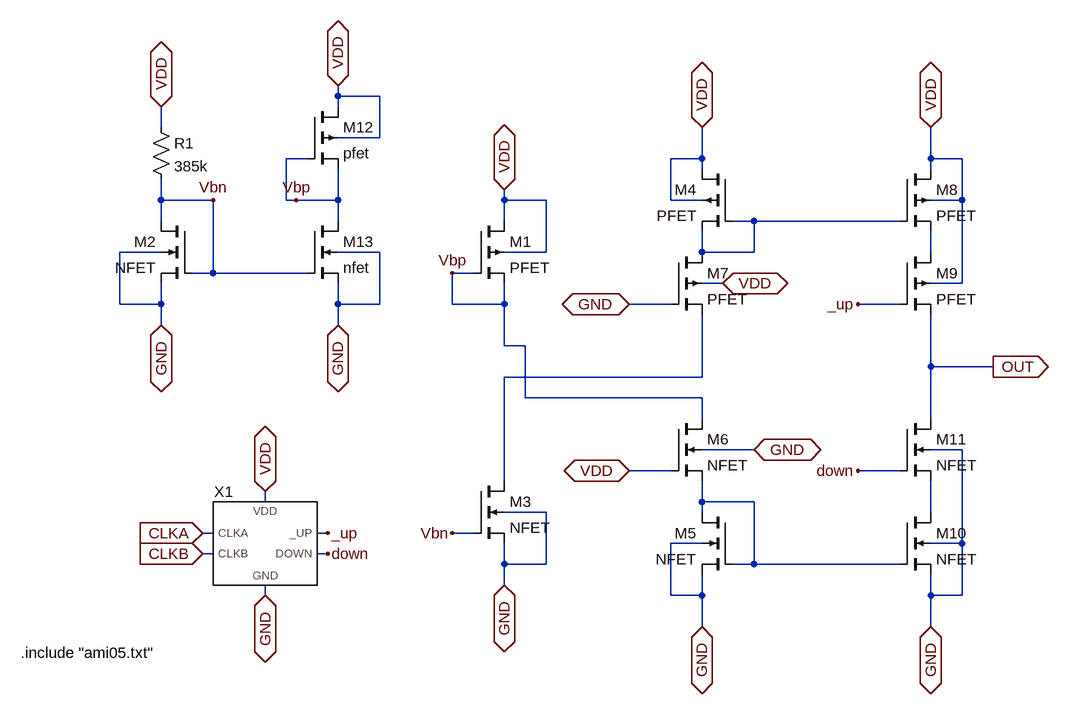
[diagram p0: schematic chargePump.asc]
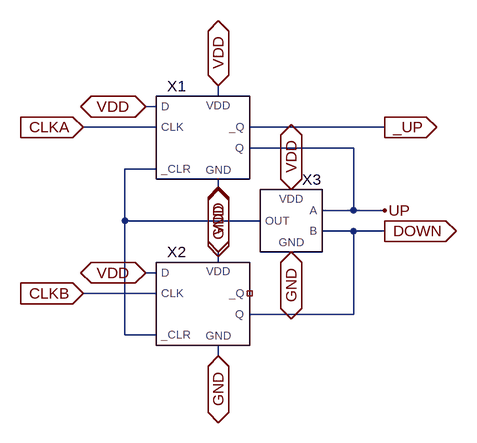
[diagram p1: sub-circuit phasedetector.asc]
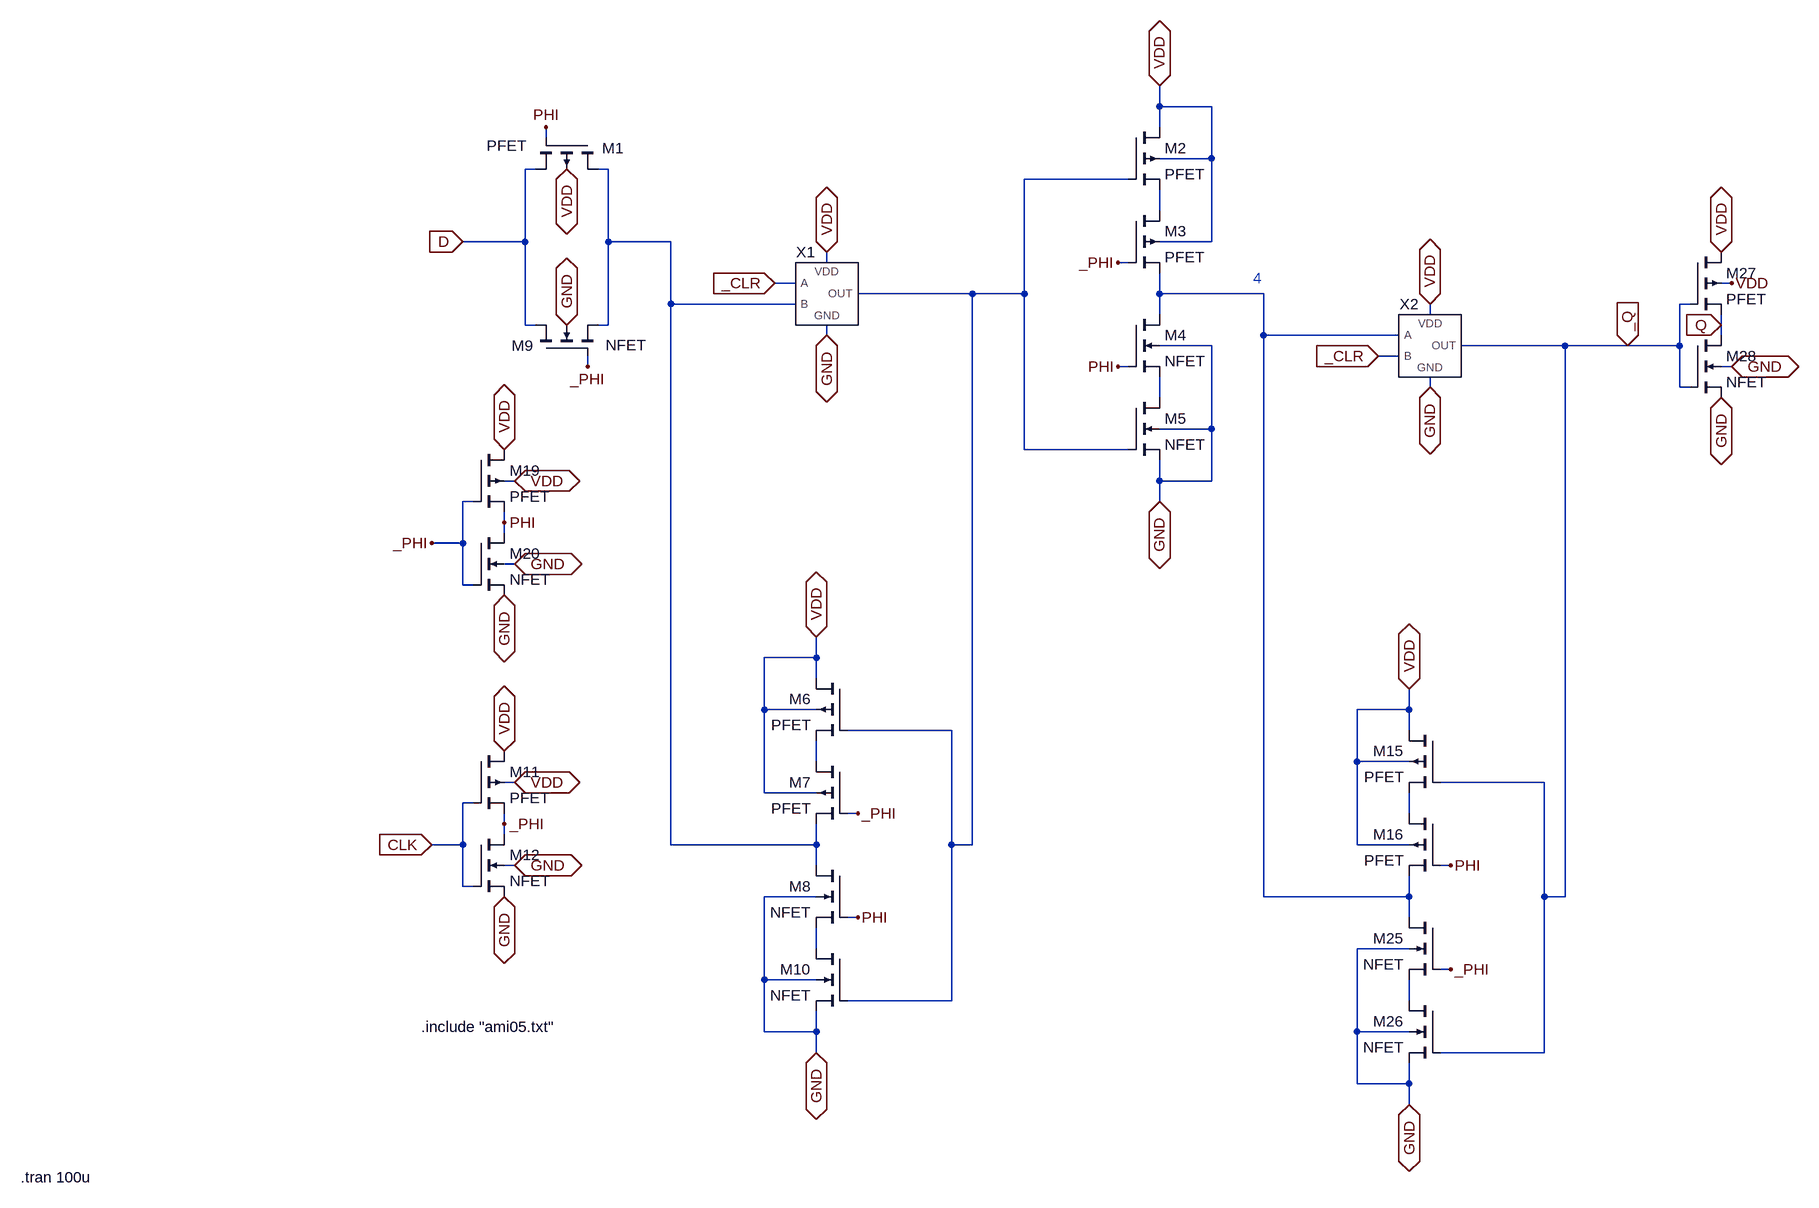
[diagram p2: sub-circuit ffd.asc]
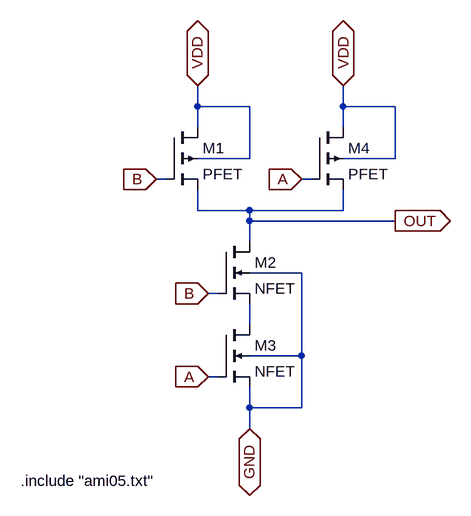
[diagram p3: sub-circuit nand.asc]
chargePump.asc, the LTspice schematic file:
Version 4
SHEET 1 1812 688
WIRE 240 -256 240 -272
WIRE 304 -256 240 -256
WIRE 240 -240 240 -256
WIRE -32 -208 -32 -240
WIRE 304 -192 304 -256
WIRE 304 -192 240 -192
WIRE 192 -160 160 -160
WIRE 800 -160 800 -208
WIRE 800 -160 752 -160
WIRE 1152 -160 1152 -208
WIRE 1200 -160 1152 -160
WIRE 800 -144 800 -160
WIRE 1152 -144 1152 -160
WIRE -32 -96 -32 -128
WIRE 48 -96 -32 -96
WIRE 160 -96 160 -160
WIRE 176 -96 160 -96
WIRE 240 -96 240 -144
WIRE 240 -96 176 -96
WIRE 496 -96 496 -112
WIRE 560 -96 496 -96
WIRE 752 -96 752 -160
WIRE 800 -96 752 -96
WIRE 1200 -96 1200 -160
WIRE 1200 -96 1152 -96
WIRE -32 -64 -32 -96
WIRE 240 -64 240 -96
WIRE 496 -64 496 -96
WIRE 880 -64 848 -64
WIRE 1104 -64 880 -64
WIRE -32 -16 -96 -16
WIRE 304 -16 240 -16
WIRE 560 -16 560 -96
WIRE 560 -16 496 -16
WIRE 800 -16 800 -48
WIRE 880 -16 880 -64
WIRE 880 -16 800 -16
WIRE 1152 -16 1152 -48
WIRE 48 16 48 -96
WIRE 48 16 16 16
WIRE 192 16 48 16
WIRE 448 16 416 16
WIRE 832 32 800 32
WIRE 1200 32 1200 -96
WIRE 1200 32 1152 32
WIRE -96 64 -96 -16
WIRE -32 64 -32 32
WIRE -32 64 -96 64
WIRE 240 64 240 32
WIRE 304 64 304 -16
WIRE 304 64 240 64
WIRE 416 64 416 16
WIRE 496 64 496 32
WIRE 496 64 416 64
WIRE 752 64 688 64
WIRE 1104 64 1040 64
WIRE -32 96 -32 64
WIRE 240 96 240 64
WIRE 496 128 496 64
WIRE 528 128 496 128
WIRE 1152 160 1152 80
WIRE 1248 160 1152 160
WIRE 800 176 800 80
WIRE 800 176 496 176
WIRE 528 208 528 128
WIRE 800 208 528 208
WIRE 800 240 800 208
WIRE 1152 240 1152 160
WIRE 880 288 800 288
WIRE 1200 288 1152 288
WIRE 752 320 688 320
WIRE 1104 320 1040 320
WIRE 496 336 496 176
WIRE 128 368 128 352
WIRE 800 368 800 336
WIRE 880 368 800 368
WIRE 560 384 496 384
WIRE 800 384 800 368
WIRE 1152 384 1152 336
WIRE 48 416 32 416
WIRE 224 416 208 416
WIRE 448 416 416 416
WIRE 800 432 752 432
WIRE 1200 432 1200 288
WIRE 1200 432 1152 432
WIRE 48 448 32 448
WIRE 224 448 208 448
WIRE 496 464 496 432
WIRE 560 464 560 384
WIRE 560 464 496 464
WIRE 880 464 880 368
WIRE 880 464 848 464
WIRE 1104 464 880 464
WIRE 496 496 496 464
WIRE 128 512 128 496
WIRE 752 512 752 432
WIRE 800 512 800 480
WIRE 800 512 752 512
WIRE 1152 512 1152 480
WIRE 1200 512 1200 432
WIRE 1200 512 1152 512
WIRE 800 560 800 512
WIRE 1152 560 1152 512
FLAG -32 -240 VDD
IOPIN -32 -240 BiDir
FLAG -32 96 GND
IOPIN -32 96 BiDir
FLAG 496 496 GND
IOPIN 496 496 BiDir
FLAG 48 -96 Vbn
FLAG 416 16 Vbp
FLAG 496 -112 VDD
IOPIN 496 -112 BiDir
FLAG 416 416 Vbn
FLAG 224 448 down
FLAG 128 352 VDD
IOPIN 128 352 BiDir
FLAG 128 512 GND
IOPIN 128 512 BiDir
FLAG 224 416 _up
FLAG 32 448 CLKB
IOPIN 32 448 In
FLAG 32 416 CLKA
IOPIN 32 416 In
FLAG 176 -96 Vbp
FLAG 240 96 GND
IOPIN 240 96 BiDir
FLAG 240 -272 VDD
IOPIN 240 -272 BiDir
FLAG 1040 64 _up
FLAG 1040 320 down
FLAG 688 320 VDD
IOPIN 688 320 BiDir
FLAG 800 -208 VDD
IOPIN 800 -208 BiDir
FLAG 1152 -208 VDD
IOPIN 1152 -208 BiDir
FLAG 832 32 VDD
IOPIN 832 32 BiDir
FLAG 800 560 GND
IOPIN 800 560 BiDir
FLAG 1152 560 GND
IOPIN 1152 560 BiDir
FLAG 688 64 GND
IOPIN 688 64 BiDir
FLAG 1248 160 OUT
IOPIN 1248 160 Out
FLAG 880 288 GND
IOPIN 880 288 BiDir
SYMBOL pmos4 448 -64 R0
SYMATTR InstName M1
SYMATTR Value2 l=1.2u w=7.8u
SYMATTR Value PFET
SYMBOL nmos4 16 -64 M0
SYMATTR InstName M2
SYMATTR Value2 l=1.2u w=2.4u
SYMATTR Value NFET
SYMBOL res -48 -224 R0
SYMATTR InstName R1
SYMATTR Value 385k
SYMBOL nmos4 448 336 R0
SYMATTR InstName M3
SYMATTR Value2 l=1.2u w=2.4u
SYMATTR Value NFET
SYMBOL phaseDetector 128 432 R0
SYMATTR InstName X1
SYMBOL pmos4 192 -240 R0
SYMATTR InstName M12
SYMATTR Value pfet
SYMATTR Value2 l=1.2u w=7.8u
SYMBOL nmos4 192 -64 R0
SYMATTR InstName M13
SYMATTR Value nfet
SYMATTR Value2 l=1.2u w=2.4u
SYMBOL pmos4 848 -144 M0
SYMATTR InstName M4
SYMATTR Value PFET
SYMATTR Value2 l=1.2u w=7.8u
SYMBOL nmos4 848 384 M0
SYMATTR InstName M5
SYMATTR Value NFET
SYMATTR Value2 l=1.2u w=2.4u
SYMBOL nmos4 752 240 R0
SYMATTR InstName M6
SYMATTR Value NFET
SYMATTR Value2 l=0.6u w=1.5u
SYMBOL pmos4 752 -16 R0
SYMATTR InstName M7
SYMATTR Value PFET
SYMATTR Value2 l=0.6u w=3u
SYMBOL pmos4 1104 -144 R0
SYMATTR InstName M8
SYMATTR Value PFET
SYMATTR Value2 l=1.2u w=7.8u
SYMBOL pmos4 1104 -16 R0
SYMATTR InstName M9
SYMATTR Value PFET
SYMATTR Value2 l=0.6u w=3u
SYMBOL nmos4 1104 384 R0
SYMATTR InstName M10
SYMATTR Value NFET
SYMATTR Value2 l=1.2u w=2.4u
SYMBOL nmos4 1104 240 R0
SYMATTR InstName M11
SYMATTR Value NFET
SYMATTR Value2 l=0.6u w=1.5u
TEXT -248 600 Left 2 !.include "ami05.txt"

phasedetector.asc, the sub-circuit schematic file:
Version 4
SHEET 1 880 680
WIRE 176 64 176 48
WIRE 80 80 64 80
WIRE 80 112 -32 112
WIRE 432 112 224 112
WIRE 384 144 224 144
WIRE 80 176 32 176
WIRE 176 208 176 192
WIRE 384 240 384 144
WIRE 384 240 336 240
WIRE 432 240 384 240
WIRE 32 256 32 176
WIRE 240 256 32 256
WIRE 384 272 336 272
WIRE 432 272 384 272
WIRE 176 320 176 304
WIRE 80 336 64 336
WIRE 80 368 -32 368
WIRE 384 400 384 272
WIRE 384 400 224 400
WIRE 32 432 32 256
WIRE 80 432 32 432
WIRE 176 464 176 448
FLAG 176 464 GND
IOPIN 176 464 BiDir
FLAG 176 208 GND
IOPIN 176 208 BiDir
FLAG 176 304 VDD
IOPIN 176 304 BiDir
FLAG 176 48 VDD
IOPIN 176 48 BiDir
FLAG 64 80 VDD
IOPIN 64 80 BiDir
FLAG 64 336 VDD
IOPIN 64 336 BiDir
FLAG -32 112 CLKA
IOPIN -32 112 In
FLAG -32 368 CLKB
IOPIN -32 368 In
FLAG 288 208 VDD
IOPIN 288 208 BiDir
FLAG 288 304 GND
IOPIN 288 304 BiDir
FLAG 432 112 _UP
IOPIN 432 112 Out
FLAG 432 272 DOWN
IOPIN 432 272 Out
FLAG 432 240 UP
SYMBOL FFD 160 144 R0
SYMATTR InstName X1
SYMBOL FFD 160 400 R0
SYMATTR InstName X2
SYMBOL NAND 288 256 M0
SYMATTR InstName X3

ffd.asc, the sub-circuit schematic file:
Version 4
SHEET 1 2988 1332
WIRE 992 -336 992 -368
WIRE 1072 -336 992 -336
WIRE 992 -304 992 -336
WIRE 48 -288 48 -304
WIRE 1072 -256 1072 -336
WIRE 1072 -256 992 -256
WIRE 32 -240 16 -240
WIRE 144 -240 128 -240
WIRE 944 -224 784 -224
WIRE 992 -176 992 -208
WIRE 16 -128 16 -240
WIRE 16 -128 -80 -128
WIRE 144 -128 144 -240
WIRE 240 -128 144 -128
WIRE 1072 -128 1072 -256
WIRE 1072 -128 992 -128
WIRE 480 -96 480 -112
WIRE 944 -96 928 -96
WIRE 432 -64 400 -64
WIRE 1872 -64 1856 -64
WIRE 704 -48 528 -48
WIRE 784 -48 784 -224
WIRE 784 -48 704 -48
WIRE 992 -48 992 -80
WIRE 1152 -48 992 -48
WIRE 240 -32 240 -128
WIRE 432 -32 240 -32
WIRE 1808 -32 1792 -32
WIRE 992 -16 992 -48
WIRE 1408 -16 1408 -32
WIRE 16 0 16 -128
WIRE 32 0 16 0
WIRE 144 0 144 -128
WIRE 144 0 128 0
WIRE 1856 0 1856 -16
WIRE 480 16 480 0
WIRE 1152 16 1152 -48
WIRE 1360 16 1152 16
WIRE 1856 16 1856 0
WIRE 1072 32 992 32
WIRE 1616 32 1456 32
WIRE 1712 32 1616 32
WIRE 1792 32 1792 -32
WIRE 1792 32 1712 32
WIRE 1360 48 1328 48
WIRE 112 64 112 48
WIRE 944 64 928 64
WIRE 1872 64 1856 64
WIRE 1408 96 1408 80
WIRE 1792 96 1792 32
WIRE 1808 96 1792 96
WIRE 992 112 992 80
WIRE 1072 160 1072 32
WIRE 1072 160 992 160
WIRE 784 192 784 -48
WIRE 944 192 784 192
WIRE 0 240 -16 240
WIRE 992 240 992 208
WIRE 1072 240 1072 160
WIRE 1072 240 992 240
WIRE -64 272 -80 272
WIRE 992 272 992 240
WIRE -16 304 -16 288
WIRE -16 320 -16 304
WIRE -80 336 -80 272
WIRE -80 336 -128 336
WIRE 0 368 -16 368
WIRE -80 400 -80 336
WIRE -64 400 -80 400
WIRE 464 512 464 480
WIRE 464 512 384 512
WIRE 464 544 464 512
WIRE 384 592 384 512
WIRE 464 592 384 592
WIRE 1376 592 1376 560
WIRE 1376 592 1296 592
WIRE 672 624 512 624
WIRE 1376 624 1376 592
WIRE 464 672 464 640
WIRE 1296 672 1296 592
WIRE 1376 672 1296 672
WIRE 0 704 -16 704
WIRE 1584 704 1424 704
WIRE 384 720 384 592
WIRE 464 720 384 720
WIRE -64 736 -80 736
WIRE 528 752 512 752
WIRE 1376 752 1376 720
WIRE -16 768 -16 752
WIRE -16 784 -16 768
WIRE -80 800 -80 736
WIRE -80 800 -128 800
WIRE 240 800 240 -32
WIRE 464 800 464 768
WIRE 464 800 240 800
WIRE 672 800 672 624
WIRE 704 800 704 -48
WIRE 704 800 672 800
WIRE 1296 800 1296 672
WIRE 1376 800 1296 800
WIRE 0 832 -16 832
WIRE 464 832 464 800
WIRE 1440 832 1424 832
WIRE -80 864 -80 800
WIRE -64 864 -80 864
WIRE 464 880 384 880
WIRE 1152 880 1152 16
WIRE 1376 880 1376 848
WIRE 1376 880 1152 880
WIRE 1584 880 1584 704
WIRE 1616 880 1616 32
WIRE 1616 880 1584 880
WIRE 528 912 512 912
WIRE 1376 912 1376 880
WIRE 464 960 464 928
WIRE 1376 960 1296 960
WIRE 1440 992 1424 992
WIRE 384 1008 384 880
WIRE 464 1008 384 1008
WIRE 672 1040 672 800
WIRE 672 1040 512 1040
WIRE 1376 1040 1376 1008
WIRE 384 1088 384 1008
WIRE 464 1088 464 1056
WIRE 464 1088 384 1088
WIRE 1296 1088 1296 960
WIRE 1376 1088 1296 1088
WIRE 464 1120 464 1088
WIRE 1584 1120 1584 880
WIRE 1584 1120 1424 1120
WIRE 1296 1168 1296 1088
WIRE 1376 1168 1376 1136
WIRE 1376 1168 1296 1168
WIRE 1376 1200 1376 1168
FLAG 80 -240 VDD
IOPIN 80 -240 BiDir
FLAG 48 -304 PHI
FLAG 112 64 _PHI
FLAG -80 -128 D
IOPIN -80 -128 In
FLAG 0 704 VDD
IOPIN 0 704 BiDir
FLAG -16 768 _PHI
FLAG -128 800 CLK
IOPIN -128 800 In
FLAG -16 880 GND
IOPIN -16 880 BiDir
FLAG 0 832 GND
IOPIN 0 832 BiDir
FLAG 80 0 GND
IOPIN 80 0 BiDir
FLAG 0 240 VDD
IOPIN 0 240 BiDir
FLAG -16 304 PHI
FLAG -128 336 _PHI
FLAG -16 416 GND
IOPIN -16 416 BiDir
FLAG 0 368 GND
IOPIN 0 368 BiDir
FLAG -16 192 VDD
IOPIN -16 192 BiDir
FLAG -16 656 VDD
IOPIN -16 656 BiDir
FLAG 992 -368 VDD
IOPIN 992 -368 BiDir
FLAG 992 272 GND
IOPIN 992 272 BiDir
FLAG 928 -96 _PHI
FLAG 928 64 PHI
FLAG 464 480 VDD
IOPIN 464 480 BiDir
FLAG 464 1120 GND
IOPIN 464 1120 BiDir
FLAG 528 752 _PHI
FLAG 528 912 PHI
FLAG 1376 560 VDD
IOPIN 1376 560 BiDir
FLAG 1376 1200 GND
IOPIN 1376 1200 BiDir
FLAG 1440 832 PHI
FLAG 1440 992 _PHI
FLAG 1872 -64 VDD
FLAG 1856 0 Q
IOPIN 1856 0 In
FLAG 1856 112 GND
IOPIN 1856 112 BiDir
FLAG 1872 64 GND
IOPIN 1872 64 BiDir
FLAG 1856 -112 VDD
IOPIN 1856 -112 BiDir
FLAG 1712 32 _Q
IOPIN 1712 32 In
FLAG 480 16 GND
IOPIN 480 16 BiDir
FLAG 1408 96 GND
IOPIN 1408 96 BiDir
FLAG 1408 -32 VDD
IOPIN 1408 -32 BiDir
FLAG 480 -112 VDD
IOPIN 480 -112 BiDir
FLAG 400 -64 _CLR
IOPIN 400 -64 In
FLAG 1328 48 _CLR
IOPIN 1328 48 In
SYMBOL pmos4 128 -288 R90
WINDOW 0 16 -40 VRight 2
WINDOW 3 12 110 VRight 2
SYMATTR InstName M1
SYMATTR Value PFET
SYMATTR Value2 l=600n w=6u
SYMBOL nmos4 32 48 R270
WINDOW 0 16 -37 VRight 2
WINDOW 3 17 108 VRight 2
SYMATTR InstName M9
SYMATTR Value NFET
SYMATTR Value2 l=600n w=3u
SYMBOL pmos4 -64 192 R0
SYMATTR InstName M19
SYMATTR Value2 l=600n w=3u
SYMATTR Value PFET
SYMBOL nmos4 -64 320 R0
SYMATTR InstName M20
SYMATTR Value2 l=600n w=1.5u
SYMATTR Value NFET
SYMBOL pmos4 944 -304 R0
SYMATTR InstName M2
SYMATTR Value2 l=600n w=6u
SYMATTR Value PFET
SYMBOL pmos4 944 -176 R0
SYMATTR InstName M3
SYMATTR Value2 l=600n w=6u
SYMATTR Value PFET
SYMBOL nmos4 944 -16 R0
SYMATTR InstName M4
SYMATTR Value2 l=600n w=3u
SYMATTR Value NFET
SYMBOL nmos4 944 112 R0
SYMATTR InstName M5
SYMATTR Value2 l=600n w=3u
SYMATTR Value NFET
SYMBOL pmos4 512 544 M0
SYMATTR InstName M6
SYMATTR Value2 l=600n w=6u
SYMATTR Value PFET
SYMBOL pmos4 512 672 M0
SYMATTR InstName M7
SYMATTR Value2 l=600n w=6u
SYMATTR Value PFET
SYMBOL nmos4 512 832 M0
SYMATTR InstName M8
SYMATTR Value2 l=600n w=3u
SYMATTR Value NFET
SYMBOL nmos4 512 960 M0
SYMATTR InstName M10
SYMATTR Value2 l=600n w=3u
SYMATTR Value NFET
SYMBOL pmos4 1424 624 M0
SYMATTR InstName M15
SYMATTR Value2 l=600n w=6u
SYMATTR Value PFET
SYMBOL pmos4 1424 752 M0
SYMATTR InstName M16
SYMATTR Value2 l=600n w=6u
SYMATTR Value PFET
SYMBOL nmos4 1424 912 M0
SYMATTR InstName M25
SYMATTR Value2 l=600n w=3u
SYMATTR Value NFET
SYMBOL nmos4 1424 1040 M0
SYMATTR InstName M26
SYMATTR Value2 l=600n w=3u
SYMATTR Value NFET
SYMBOL pmos4 1808 -112 R0
SYMATTR InstName M27
SYMATTR Value2 l=600n w=3u
SYMATTR Value PFET
SYMBOL nmos4 1808 16 R0
SYMATTR InstName M28
SYMATTR Value2 l=600n w=1.5u
SYMATTR Value NFET
SYMBOL NAND 480 -48 R0
SYMATTR InstName X1
SYMBOL NAND 1408 32 R0
SYMATTR InstName X2
SYMBOL pmos4 -64 656 R0
SYMATTR InstName M11
SYMATTR Value2 l=600n w=3u
SYMATTR Value PFET
SYMBOL nmos4 -64 784 R0
SYMATTR InstName M12
SYMATTR Value2 l=600n w=1.5u
SYMATTR Value NFET
TEXT -144 1080 Left 2 !.include "ami05.txt"
TEXT -760 1312 Left 2 !.tran 100u
TEXT 1136 -72 Left 2 ;4

nand.asc, the sub-circuit schematic file:
Version 4
SHEET 1 880 680
WIRE 32 -96 32 -128
WIRE 112 -96 32 -96
WIRE 256 -96 256 -128
WIRE 336 -96 256 -96
WIRE 32 -64 32 -96
WIRE 256 -64 256 -96
WIRE 112 -16 112 -96
WIRE 112 -16 32 -16
WIRE 336 -16 336 -96
WIRE 336 -16 256 -16
WIRE -16 16 -32 16
WIRE 208 16 192 16
WIRE 32 64 32 32
WIRE 112 64 32 64
WIRE 256 64 256 32
WIRE 256 64 112 64
WIRE 112 80 112 64
WIRE 336 80 112 80
WIRE 112 112 112 80
WIRE 192 160 112 160
WIRE 64 192 48 192
WIRE 112 240 112 208
WIRE 192 288 192 160
WIRE 192 288 112 288
WIRE 64 320 48 320
WIRE 112 368 112 336
WIRE 192 368 192 288
WIRE 192 368 112 368
WIRE 112 400 112 368
FLAG 112 400 GND
IOPIN 112 400 BiDir
FLAG 32 -128 VDD
IOPIN 32 -128 BiDir
FLAG 256 -128 VDD
IOPIN 256 -128 BiDir
FLAG 192 16 A
IOPIN 192 16 In
FLAG 48 320 A
IOPIN 48 320 In
FLAG 48 192 B
IOPIN 48 192 In
FLAG -32 16 B
IOPIN -32 16 In
FLAG 336 80 OUT
IOPIN 336 80 Out
SYMBOL pmos4 -16 -64 R0
SYMATTR InstName M1
SYMATTR Value2 l=600n w=3u
SYMATTR Value PFET
SYMBOL nmos4 64 112 R0
SYMATTR InstName M2
SYMATTR Value2 l=600n w=3u
SYMATTR Value NFET
SYMBOL nmos4 64 240 R0
SYMATTR InstName M3
SYMATTR Value2 l=600n w=3u
SYMATTR Value NFET
SYMBOL pmos4 208 -64 R0
SYMATTR InstName M4
SYMATTR Value2 l=600n w=3u
SYMATTR Value PFET
TEXT -240 480 Left 2 !.include "ami05.txt"

The netlist it stands for:
* chargePump.asc
M1 VDD Vbp Vbp VDD PFET l=1.2u w=7.8u
M2 Vbn Vbn GND GND NFET l=1.2u w=2.4u
R1 VDD Vbn 385k
M3 N003 Vbn GND GND NFET l=1.2u w=2.4u
XX1 CLKA CLKB down GND _up VDD phasedetector
M12 VDD Vbp Vbp VDD pfet l=1.2u w=7.8u
M13 Vbp Vbn GND GND nfet l=1.2u w=2.4u
M4 VDD N001 N001 VDD PFET l=1.2u w=7.8u
M5 N004 N004 GND GND NFET l=1.2u w=2.4u
M6 Vbp VDD N004 GND NFET l=0.6u w=1.5u
M7 N001 GND N003 VDD PFET l=0.6u w=3u
M8 VDD N001 N002 VDD PFET l=1.2u w=7.8u
M9 N002 _up OUT VDD PFET l=0.6u w=3u
M10 N005 N004 GND GND NFET l=1.2u w=2.4u
M11 OUT down N005 GND NFET l=0.6u w=1.5u

* block symbol definitions
.subckt phasedetector CLKA CLKB DOWN GND _UP VDD
XX1 N001 CLKA VDD UP _UP GND VDD ffd
XX2 N001 CLKB VDD DOWN NC_01 GND VDD ffd
XX3 UP DOWN GND N001 VDD nand
.ends phasedetector

.subckt ffd _CLR CLK D Q _Q GND VDD
M1 N001 PHI D VDD PFET l=600n w=6u
M9 D _PHI N001 GND NFET l=600n w=3u
M19 VDD _PHI PHI VDD PFET l=600n w=3u
M20 PHI _PHI GND GND NFET l=600n w=1.5u
M2 VDD N002 N003 VDD PFET l=600n w=6u
M3 N003 _PHI N004 VDD PFET l=600n w=6u
M4 N004 PHI N005 GND NFET l=600n w=3u
M5 N005 N002 GND GND NFET l=600n w=3u
M6 VDD N002 N006 VDD PFET l=600n w=6u
M7 N006 _PHI N001 VDD PFET l=600n w=6u
M8 N001 PHI N008 GND NFET l=600n w=3u
M10 N008 N002 GND GND NFET l=600n w=3u
M15 VDD _Q N007 VDD PFET l=600n w=6u
M16 N007 PHI N004 VDD PFET l=600n w=6u
M25 N004 _PHI N009 GND NFET l=600n w=3u
M26 N009 _Q GND GND NFET l=600n w=3u
M27 VDD _Q Q VDD PFET l=600n w=3u
M28 Q _Q GND GND NFET l=600n w=1.5u
XX1 _CLR N001 GND N002 VDD nand
XX2 N004 _CLR GND _Q VDD nand
M11 VDD CLK _PHI VDD PFET l=600n w=3u
M12 _PHI CLK GND GND NFET l=600n w=1.5u
.include "ami05.txt"
.tran 100u
* 4
.ends ffd

.subckt nand A B GND OUT VDD
M1 VDD B OUT VDD PFET l=600n w=3u
M2 OUT B N001 GND NFET l=600n w=3u
M3 N001 A GND GND NFET l=600n w=3u
M4 VDD A OUT VDD PFET l=600n w=3u
.include "ami05.txt"
.ends nand

.model NMOS NMOS
.model PMOS PMOS
.lib standard.mos
.include "ami05.txt"
.backanno
.end